# EAGLE design ODMSpotWelder (EAGLE 9.3.1)
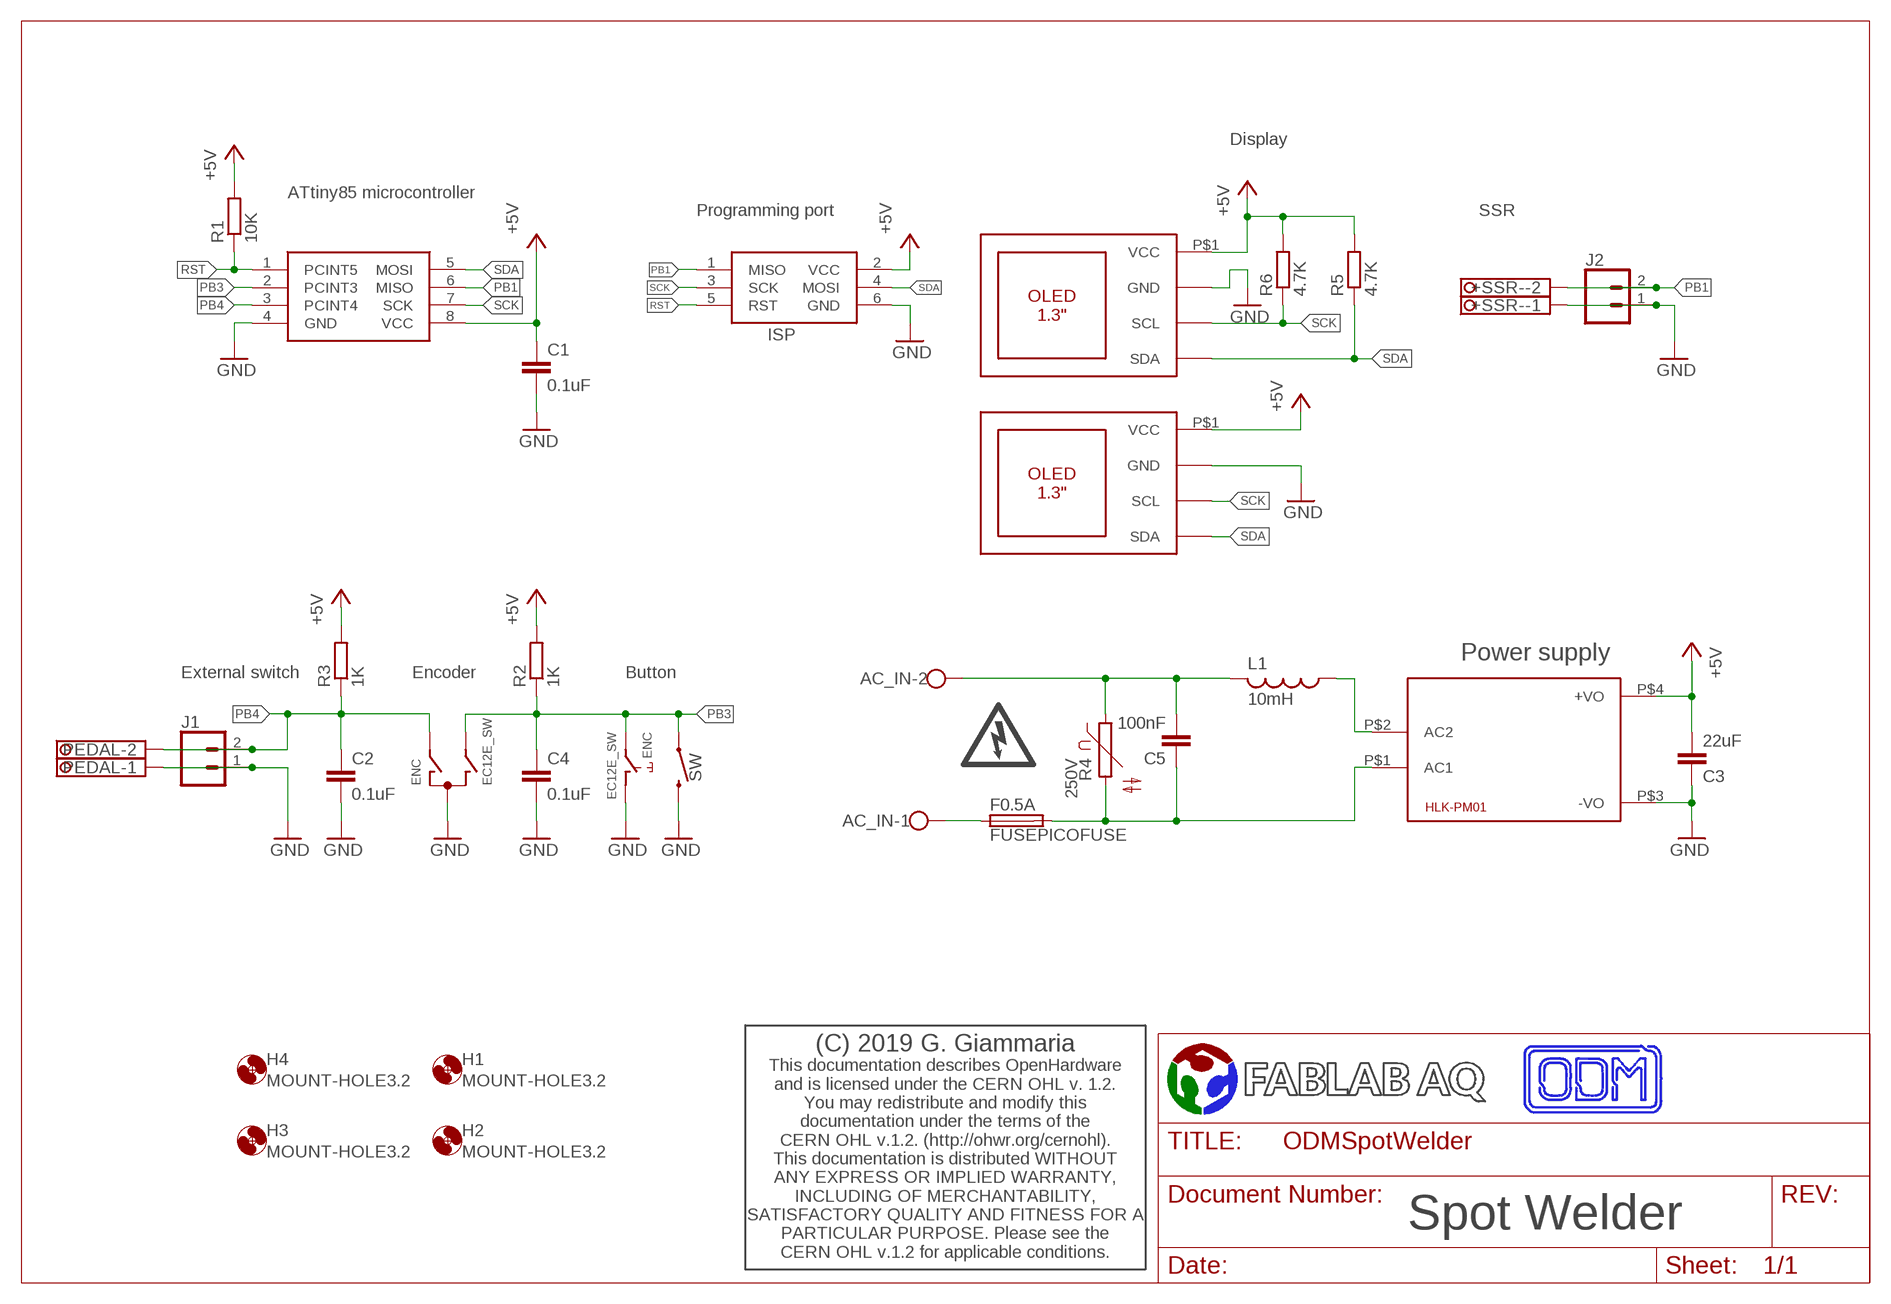
[diagram p0: schematic, sheet 1]

## Parts
+SSR-  TERMINAL-BLOCK-3.5MM-2-PIN-LONG-PAD  [TERMINAL-BLOCK-2-PIN-3.5MM-LONG-PAD]
AC_IN  W237-102  [W237-102]
C1  0.1uF  C-EUC0603K  [C0603K]
C2  0.1uF  C-EUC0603K  [C0603K]
C3  22uF  C-EUC0805K  [C0805K]
C4  0.1uF  C-EUC0603K  [C0603K]
C5  100nF  C-EU102-064X133  [C102-064X133]
ENC  EC12E_SW  [ALPS_EC12E_SW]
F0.5A  FUSEPICOFUSE  [PICOFUSE]
H1  MOUNT-HOLE3.2  [3,2]
H2  MOUNT-HOLE3.2  [3,2]
H3  MOUNT-HOLE3.2  [3,2]
H4  MOUNT-HOLE3.2  [3,2]
HLK-PM01  HLK-PM01  HLK-PMXX3W  [HLK-PMXX]
IC2  ATTINY85-20SU  [SOT127P798X216-8N]
ISP  AVRISP-6  [AVRISP]
J1  CONN_021X02_NO_SILK  [1X02_NO_SILK]
J2  CONN_021X02_NO_SILK  [1X02_NO_SILK]
L1  10mH  L-US6000-XXX-RC  [6000-XXXX-RC]
PEDAL  TERMINAL-BLOCK-3.5MM-2-PIN-LONG-PAD  [TERMINAL-BLOCK-2-PIN-3.5MM-LONG-PAD]
R1  10K  R-EU_R0603  [R0603]
R2  1K  R-EU_R0603  [R0603]
R3  1K  R-EU_R0603  [R0603]
R4  250V  S07K250  [S07K250]
R5  4.7K  R-EU_R0603  [R0603]
R6  4.7K  R-EU_R0603  [R0603]
SW  MOMENTARY-SWITCH-SPST-PTH-6.0MM  [TACTILE_SWITCH_PTH_6.0MM]
U$1  (C) 2019 G. Giammaria  CERN_OHL_1.2  [DOC_CERN_OHL_1.2]
U$2  HV_SYMBOL  [HV_SYMBOL_10X10]
U$4  FABLABAQ_LOGOINLINE_4.5X20  [SILK_INLINE_4.5X20]
U$5  ODM_LOGO  [ODM_6X12]
U$6  OLED_1.3_I2C  [OLED_1.3_I2C]
U$7  OLED_1.3_I2C  [OLED_1.3_I2C]

## Nets
+5V: C1.1 C3.2 HLK-PM01.P$4(+VO) IC2.8(VCC) ISP.2(VCC) R1.2 R2.2 R3.2 R5.2 R6.2 U$6.P$1(VCC) U$7.P$1(VCC)
GND: +SSR-.1 C1.2 C2.2 C3.1 C4.2 ENC.C ENC.D HLK-PM01.P$3(-VO) IC2.4(GND) ISP.6(GND) J1.1 J2.1 PEDAL.1 SW.3 U$6.P$2(GND) U$7.P$2(GND)
N$5: HLK-PM01.P$2(AC2) L1.1
N$9: AC_IN.2 C5.2 L1.2 R4.1
N$11: AC_IN.1 F0.5A.1
N$13: C5.1 F0.5A.2 HLK-PM01.P$1(AC1) R4.2
PB1: +SSR-.2 IC2.6(MISO) ISP.1(MISO) J2.2
PB3: C4.1 ENC.B ENC.E IC2.2(PCINT3) R2.1 SW.1
PB4: C2.1 ENC.A IC2.3(PCINT4) J1.2 PEDAL.2 R3.1
RST: IC2.1(PCINT5) ISP.5(RST) R1.1
SCK: IC2.7(SCK) ISP.3(SCK) R6.1 U$6.P$3(SCL) U$7.P$3(SCL)
SDA: IC2.5(MOSI) ISP.4(MOSI) R5.1 U$6.P$4(SDA) U$7.P$4(SDA)
Unconnected: ENC.GND1(G) ENC.GND2(G)

## Notes on the sheet
- Display
- ATtiny85 microcontroller
- Programming port | SSR
- Power supply
- External switch | Encoder | Button
- Spot Welder

## Library data of the parts
+SSR- PEDAL = Rembrandt Electronics - Terminal Block 3-5mm v1-0:TERMINAL-BLOCK-3.5MM-2-PIN: Terminal Block 3.5mm Pitch: 3,5 mm Number of pins: 2 Created by Rembrandt Electronics www.rembrandtelectronics.com
AC_IN = con-wago-500:W237-102: WAGO SCREW CLAMP; MPN: 237-102; OC_FARNELL: unknown; OC_NEWARK: 70K9898
C1-C5 = rcl:C-EU: CAPACITOR, European symbol; SPICEPREFIX: C
ENC = switch-alps:EC12E_SW: ALPS rotary Encoder EC12E series with switch; MPN: EC12E2424407; OC_FARNELL: 1520813; OC_NEWARK: 74M1068
F0.5A = fuse:FUSE: Fuse; OC_FARNELL: unknown; OC_NEWARK: unknown
H1-H4 = holes:MOUNT-HOLE: MOUNTING HOLE with drill center marker
HLK-PM01 = HLK-PM01:HLK-PMXX: Hi-Link Power Supply HLK-PM01 3W Author: Ahmed Said <https://github.com/AhmedSaid/EAGLELibraries>
IC2 = ATTINY85-20SU:ATTINY85-20SU: MICROCHIP - ATTINY85-20SU - MICROCONTROLLER MCU, 8 BIT, ATTINY, 20MHZ, SOIC-8 Source: Datasheet <https://componentsearchengine.com/Datasheets/2/ATTINY85-20SU.pdf>; DESCRIPTION: MICROCHIP - ATTINY85-20SU - MICROCONTROLLER MCU, 8 BIT, ATTINY, 20MHZ, SOIC-8; HEIGHT: 2.16mm; MANUFACTURER_NAME: Microchip; MANUFACTURER_PART_NUMBER: ATTINY85-20SU; MOUSER_PART_NUMBER: 556-ATTINY85-20SU; MOUSER_PRICE-STOCK: https://www.mouser.com/Search/Refine.aspx?Keyword=556-ATTINY85-20SU; RS_PART_NUMBER: 1331674; RS_PRICE-STOCK: http://uk.rs-online.com/web/p/products/1331674
ISP = adafruit:AVRISP: AVR ISP HEADER Standard 6 pin header for AVR programming
J1 J2 = SparkFun-Connectors:CONN_02: Multi connection point. Often used as Generic Header-pin footprint for 0.1 inch spaced/style header connections On any of the 0.1 inch spaced packages, you can populate with these: Break Away Headers - Straight <https://www.sparkfun.com/products/116> (PRT-00116) Break Away Male Headers - Right Angle <https://www.sparkfun.com/products/553> (PRT-00553) Female Headers <https://www.sparkfun.com/products/115> (PRT-00115) Break Away Headers - Machine Pin <https://www.sparkfun.com/products/117> (PRT-00117) Break Away Female Headers - Swiss Machine Pin <https://www.sparkfun.com/products/743> (PRT-00743) For SCREWTERMINALS and SPRING TERMINALS visit here: Screw Terimnals on SparkFun.com <https://www.sparkfun.com/search/results?term=Screw+Terminals> (5mm/3.5mm/2.54mm spacing) This device is also useful as a general connection point to wire up your design to another part of your project. Our various solder wires solder well into these plated through hole pads. Hook-Up Wire - Assortment (Stranded, 22 AWG) <https://www.sparkfun.com/products/11375> (PRT-11375) Hook-Up Wire - Assortment (Solid Core, 22 AWG) <https://www.sparkfun.com/products/11367> (PRT-11367) View the entire wire category on our website here <https://www.sparkfun.com/categories/141> Special notes: Molex polarized connector foot print use with: PRT-08233 with associated crimp pins and housings. 2.54_SCREWTERM for use with PRT-10571. 3.5mm Screw Terminal footprints for PRT-08084 5mm Screw Terminal footprints for use with PRT-08432
L1 = rcl:L-US: INDUCTOR, American symbol; SPICEPREFIX: L
R1-R3 R5 R6 = rcl:R-EU_: RESISTOR, European symbol; SPICEPREFIX: R
R4 = varistor:S07K250: VARISTOR
SW = SparkFun-Switches:MOMENTARY-SWITCH-SPST: Momentary Switch (Pushbutton) - SPST Normally-open (NO) SPST momentary switches (buttons, pushbuttons). Variants PTH-12MM - 12mm square, through-hole Momentary Pushbutton Switch - 12mm Square <https://www.sparkfun.com/products/9190> (COM-09190) PTH-6.0MM, PTH-6.0MM-KIT - 6.0mm square, through-hole Mini Pushbutton Switch <https://www.sparkfun.com/products/97> (COM-00097) KIT package intended for soldering kit's - only one side of pads' copper is exposed. PTH-RIGHT-ANGLE-KIT - Right-angle, through-hole Right Angle Tactile Button <https://www.sparkfun.com/products/10791> - Used on SparkFun BigTime Watch Kit <https://www.sparkfun.com/products/11734> SMD-12MM - 12mm square, surface-mount Tactile Button - SMD (12mm) <https://www.sparkfun.com/products/12993> (COM-12993) Used on SparkFun PicoBoard <https://www.sparkfun.com/products/11888> SMD-4.5MM - 4.5mm Square Trackball Switch Used on SparkFun Blackberry Trackballer Breakout <https://www.sparkfun.com/products/13169> SMD-4.6MMX2.8MM - 4.60mm x 2.80mm, surface mount Used on SparkFun SAMD21 Mini Breakout <https://www.sparkfun.com/products/13664> SMD-5.2MM, SMD-5.2-REDUNDANT - 5.2mm square, surface-mount Mini Pushbutton Switch - SMD <https://www.sparkfun.com/products/8720> (COM-08720) Used on Arduino Pro Mini <https://www.sparkfun.com/products/11114> REDUNDANT package connects both switch circuits together SMD-6.0X3.5MM - 6.0 x 3.5mm, surface mount Momentary Reset Switch SMD <https://www.sparkfun.com/products/8229> (COM-08229) SMD-6.2MM-TALL - 6.2mm square, surface mount Tactile Button - SMD (6mm) <https://www.sparkfun.com/products/12992> Used on SparkFun Digital Sandbox <https://www.sparkfun.com/products/12651> SMD-RIGHT-ANGLE - Right-angle, surface mount Used on SparkFun Block for Intel® Edison - Arduino <https://www.sparkfun.com/products/13036>; PROD_ID: SWCH-08441; SF_SKU: COM-00097
U$1 = CERN_OHL_1.2:CERN_OHL_1.2
U$2 = FabLab eagle logo:HV_SYMBOL
U$4 = FabLab eagle logo:FABLABAQ_LOGO
U$5 = FabLab eagle logo:ODM_LOGO
U$6 U$7 = OLED_1.3:OLED_1.3_I2C

## Net classes
0 default: clearance 0.205 mm

## Board
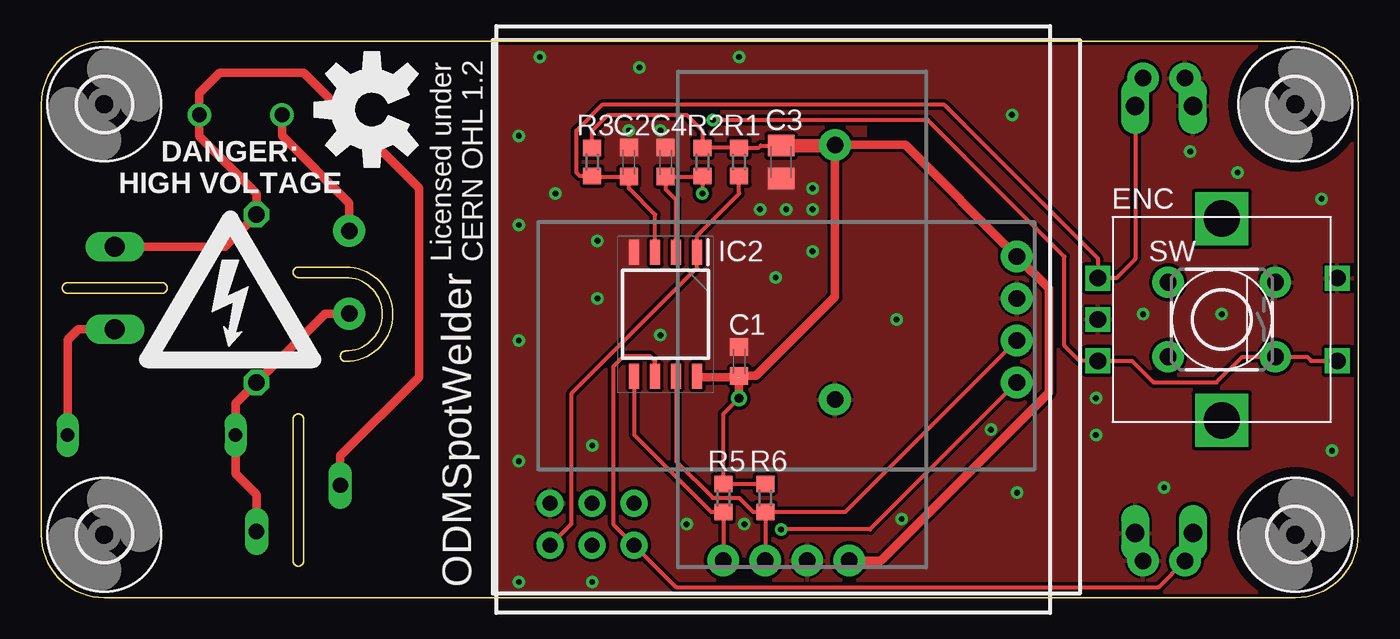
[diagram p1: board, top side]
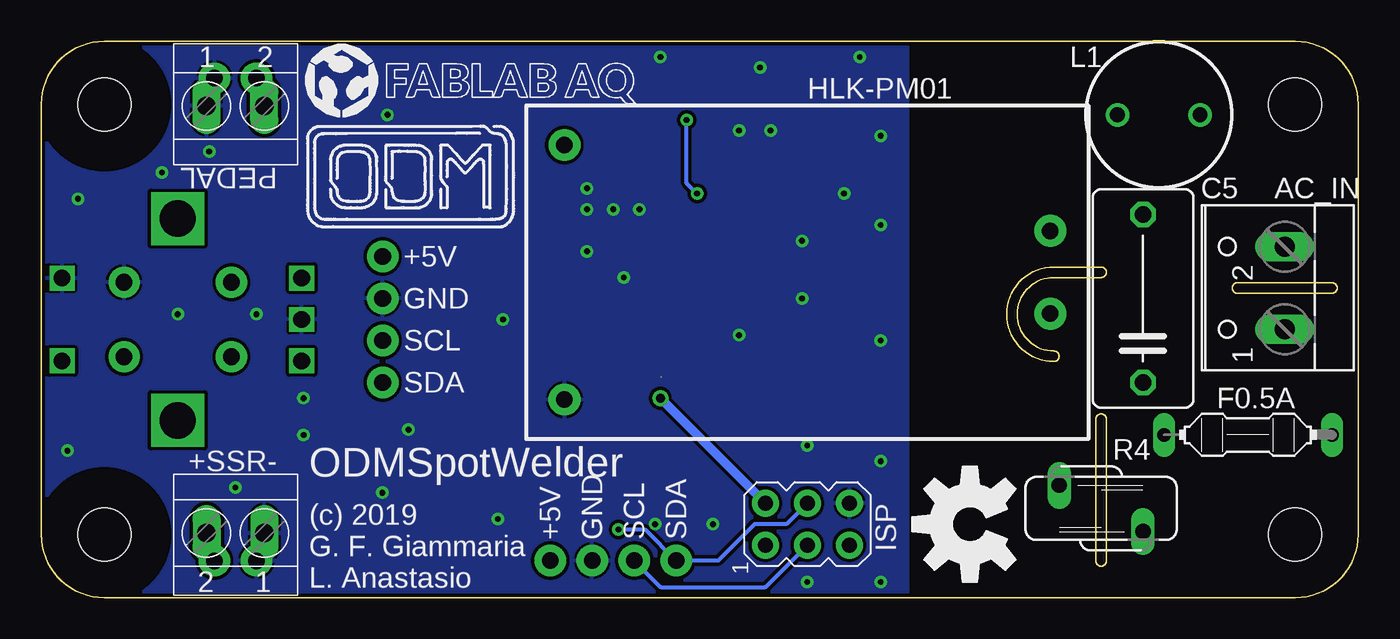
[diagram p2: board, bottom side, seen from below]

Size 79.69 x 33.66 mm. Coordinates in mm from the lower left corner, seen from the top.
Outline: 15.24,2.22 15.24,10.79 arc-180 15.88,10.79 15.88,2.22 arc-180 15.24,2.22
Outline: 18.42,14.92 arc90 20.64,17.14 arc90 18.42,19.37 15.56,19.37 arc-180 15.56,20 18.42,20 arc-90 21.27,17.14 arc-90 18.42,14.29 arc-180 18.42,14.92
Outline: 1.59,18.41 7.3,18.41 arc180 7.3,19.05 1.59,19.05 arc180 1.59,18.41
Outline: 75.88,0 arc90 79.69,3.81 79.69,29.84 arc90 75.88,33.66 3.81,33.66 arc90 0,29.84 0,3.81 arc90 3.81,0 75.88,0
Copper layers (1*16): Top 0.035mm / dielectric 1.5mm / Bottom 0.035mm
Design rules "default *": minimum track width 6mil, minimum drill 0.35mm, track to track 6mil, track to pad 6mil, pad to pad 6mil, via to via 6mil, smd to smd 0mil, copper to edge 8mil, drill to drill 6mil, minimum pad ring 10mil, minimum via ring 8mil, stop-mask expansion 4mil, vias tented up to drill 25mil, thermal gap 6mil
tRestrict: 1 lines
bRestrict: 1 lines

### Footprints (pad centres in the part's own frame; a part is rotated, then mirrored left to right if it is on the bottom)
TERMINAL-BLOCK-2-PIN-3.5MM-LONG-PAD = drill 1.1 pad 1.7 long: 1 -1.75,-0.1; 2 1.75,-0.1
W237-102 = drill 1.194 long: 1 -2.5,-1.27; 2 2.5,-1.27
C0603K = smd 1.05 x 1.08: 1 -0.875,0; 2 0.875,0
C0805K = smd 1.3 x 1.6: 1 -1,0; 2 1,0
C102-064X133 = drill 1.016 octagon: 1 -5.08,0; 2 5.08,0
ALPS_EC12E_SW = drill 1 square: A -2.5,-7.5; B 2.5,-7.5; C 0,-7.5; D -2.5,7; E 2.5,7 | drill 2.2 square: GND1 -6.1,0; GND2 6.1,0
PICOFUSE = drill 0.813 long: 1 -5.08,0; 2 5.08,0
3,2 = hole 3.2: 0,0
HLK-PMXX = drill 1.016 pad 1.93: P$1 -14.7,2.5; P$2 -14.7,-2.5; P$3 14.7,7.7; P$4 14.7,-7.7
SOT127P798X216-8N = smd 1.5 x 0.6: 1 -3.75,1.905; 2 -3.75,0.635; 3 -3.75,-0.635; 4 -3.75,-1.905; 5 3.75,-1.905; 6 3.75,-0.635; 7 3.75,0.635; 8 3.75,1.905
AVRISP = drill 0.9 pad 1.626: 1 -1.27,2.54; 2 1.27,2.54; 3 -1.27,0; 4 1.27,0; 5 -1.27,-2.54; 6 1.27,-2.54
1X02_NO_SILK = drill 1.016 pad 1.88: 1 0,0; 2 2.54,0
6000-XXXX-RC = drill 0.9 pad 1.422: 1 -2.5,0; 2 2.5,0
R0603 = smd 1 x 1.1: 1 -0.85,0; 2 0.85,0
S07K250 = drill 0.914 long: 1 -1.397,-2.54; 2 1.397,2.54
TACTILE_SWITCH_PTH_6.0MM = drill 1.016 pad 1.88: 1 -3.251,2.261; 2 3.251,2.261; 3 -3.251,-2.261; 4 3.251,-2.261
OLED_1.3_I2C = drill 1 pad 1.905: P$1 -3.81,13; P$2 -1.27,13; P$3 1.27,13; P$4 3.81,13

### Placement (x,y rotation side)
+SSR-  67.94,3.81 180 bottom
AC_IN  5.71,18.73 90 bottom
C1  42.23,14.29 90 top
C2  35.56,26.35 90 top
C3  44.77,26.35 90 top
C4  37.78,26.35 90 top
C5  13.02,18.1 90 bottom
ENC  71.44,16.83 270 top
F0.5A  6.67,9.84 180 bottom
H1  3.81,29.84 180 top
H2  75.88,3.81 180 top
H3  3.81,3.81 180 top
H4  75.88,29.84 180 top
HLK-PM01  33.34,19.68 180 bottom
IC2  37.78,17.14 270 top
ISP  33.34,4.44 90 bottom
J1  69.22,31.43 180 top
J2  66.67,2.22 0 top
L1  12.06,29.21 0 bottom
PEDAL  67.94,29.84 0 bottom
R1  42.23,26.35 90 top
R2  40,26.35 90 top
R3  33.34,26.35 90 top
R4  15.56,5.4 270 bottom
R5  41.27,6.03 90 top
R6  43.81,6.03 90 top
SW  71.44,16.83 180 top
U$1  45.4,17.61 180 top
U$2  11.43,18.1 0 top
U$3  [OSHW-LOGO-L]  23.49,4.44 90 bottom
U$4  63.73,29.08 0 bottom
U$5  63.63,22.4 0 bottom
U$6  46.04,16.83 270 top
U$7  45.09,15.24 180 top
U$8  [OSHW-LOGO-L]  20,29.53 90 top

### Tracks (layer width: path | path; a pad name or v marks a point on that pad's centre or on a via)
+5V  (via drill 0.55)  (1 unrouted)
  Top 0.254: R3.2 33.34,28.26 34.29,29.21 39.05,29.21 40.01,28.26 R2.2 R1.2 43.39,27.2 43.54,27.35 C3.2 | R6.2 R5.2 41.28,11.11 v42.23,12.06
  Top 0.508: 48.01,27.35 HLK-PM01.P$4 | 42.3,13.41 42.23,13.33 | C1.1 43.26,13.41 48.04,18.19 HLK-PM01.P$4 | U$7.P$1 50.82,2.24 60.96,12.38 60.96,18.71 U$6.P$1 52.29,27.38 HLK-PM01.P$4 | IC2.8 39.75,13.33 42.15,13.33 C1.1 | C1.1 v42.23,12.06
  Top 0.813: C3.2 48.01,27.35
  Bottom 0.152: 59.2,20.52 U$6.P$1
  Bottom 0.508: ISP.2 v42.23,12.06
GND  (via drill 0.35)
  other vias: 35.56,28.26 37.46,28.26 33.66,21.59 33.66,18.1 28.89,27.94 28.89,22.54 28.89,15.56 28.89,8.25 78.1,8.89 77.47,24.13 69.53,26.99 58.74,29.21 36.2,32.07 30.16,32.7 51.75,16.83 44.45,19.37 45.09,23.49 43.5,23.49 46.67,24.77 46.67,23.49 46.67,20.95 37.46,15.87 39.05,4.44 33.34,0.95 28.89,0.95 63.82,12.06 63.82,9.84 59.05,6.35 57.47,10.16 71.44,17.14 66.67,17.14 72.39,25.72 42.23,32.7 67.94,6.67 33.34,9.21 31.11,24.45 52.07,4.76 42.55,4.44
  pour Top: 27.3,33.66 27.3,0 79.69,0 79.69,33.66
  pour Bottom: 27.3,33.66 27.3,0 79.69,0 79.69,33.66
  pour Top (no thermals): 33.34,28.57 49.85,28.57 49.85,13.33 33.34,13.33
N$5
  Top 0.508: L1.1 14.56,27.94 18.64,23.87 HLK-PM01.P$2
N$9
  Top 0.508: AC_IN.2 11.11,21.23 11.11,21.27 C5.2 13.02,24.45 9.56,27.9 L1.2 9.56,30.52 10.79,31.75 15.88,31.75 22.86,24.77 22.86,13.33 18.1,8.57 R4.1
N$11
  Top 0.508: F0.5A.1 1.59,12.06 1.59,15.6 2.22,16.23 AC_IN.1
N$13
  Top 0.508: R4.2 13.02,6.22 11.75,7.49 F0.5A.2 11.75,11.75 C5.1 17.19,17.18 HLK-PM01.P$1
PB1
  Top 0.254: IC2.6 37.15,14.29 36.83,14.6 35.24,14.6 34.61,13.97 34.61,4.44 ISP.1 38.42,0.63 67.63,0.63 J2.2 69.7,2.7 +SSR-.2
PB3  (via drill 0.35)
  Top 0.254: IC2.2 38.42,24.07 37.78,24.7 C4.1 39.98,25.48 R2.1 v40.01,24.45 | v40.64,28.89 53.66,28.89 61.91,20.64 61.91,15.24 62.83,14.33 ENC.B 66,14.33 67.31,13.02 71.12,13.02 72.67,14.57 SW.1 76.61,14.57 76.85,14.33 ENC.E
  Bottom 0.254: v40.64,28.89 40.64,25.08 v40.01,24.45
PB4
  Top 0.254: IC2.3 37.15,23.18 35.56,24.77 C2.1 33.36,25.48 R3.1 32.6,25.5 32.38,25.72 32.38,28.26 33.97,29.84 54.61,29.84 63.94,20.52 ENC.A 65.05,19.33 66.2,20.47 PEDAL.2 66.2,30.95 J1.2
RST
  Top 0.254: ISP.5 32.07,4.44 32.07,12.32 39.69,19.94 IC2.1 39.69,21.91 42.23,24.45 R1.1
SCK
  Top 0.254: IC2.7 38.42,8.25 40.64,6.03 42.23,6.03 43.08,5.18 R6.1 | R6.1 U$7.P$3 | R6.1 48.66,5.18 U$6.P$3
  Bottom 0.254: U$7.P$3 42.21,0.63 35.88,0.63 ISP.3
SDA  (via drill 0.35)
  Top 0.254: IC2.5 35.88,9.84 40.54,5.18 R5.1 U$7.P$4 | U$6.P$4 50.15,4.13 v44.77,4.13
  Bottom 0.254: ISP.4 34.61,4.44 36.53,4.44 38.73,2.24 U$7.P$4 43.16,4.13 v44.77,4.13

### Text on the board
tPlace: DANGER: / HIGH VOLTAGE | ODMSpotWelder
bPlace: +5V | GND | SCL | SDA | ODMSpotWelder | SDA | SCL | GND | +5V
tNames: Licensed under / CERN OHL 1.2
bNames: (c) 2019 / G. F. Giammaria / L. Anastasio